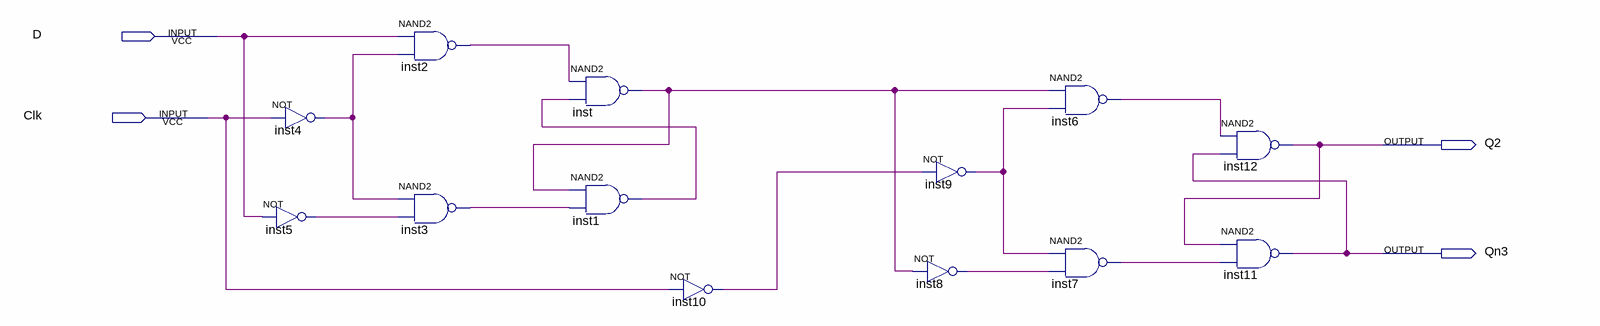
[diagram p0: schematic sheet]
// Quartus schematic Ex7_FlipFlop.bdf as structural Verilog: 13 symbols, 4 pins
module Ex7_FlipFlop (
  input  D,
  input  Clk,
  output Q2,
  output Qn3
);

  wire inst1_out, inst2_out, inst3_out, inst4_out, inst5_out, inst6_out, inst7_out, inst8_out, inst9_out,
       inst10_out, inst_out;

  not inst4 (inst4_out, Clk);
  not inst5 (inst5_out, D);
  nand inst2 (inst2_out, D, inst4_out);
  nand inst3 (inst3_out, inst4_out, inst5_out);
  nand inst (inst_out, inst2_out, inst1_out);
  nand inst1 (inst1_out, inst_out, inst3_out);
  not inst10 (inst10_out, Clk);
  not inst9 (inst9_out, inst10_out);
  not inst8 (inst8_out, inst_out);
  nand inst6 (inst6_out, inst_out, inst9_out);
  nand inst7 (inst7_out, inst9_out, inst8_out);
  nand inst12 (Q2, inst6_out, Qn3);
  nand inst11 (Qn3, Q2, inst7_out);
endmodule
